# Altium project Microscope_Lamp.PrjPcb
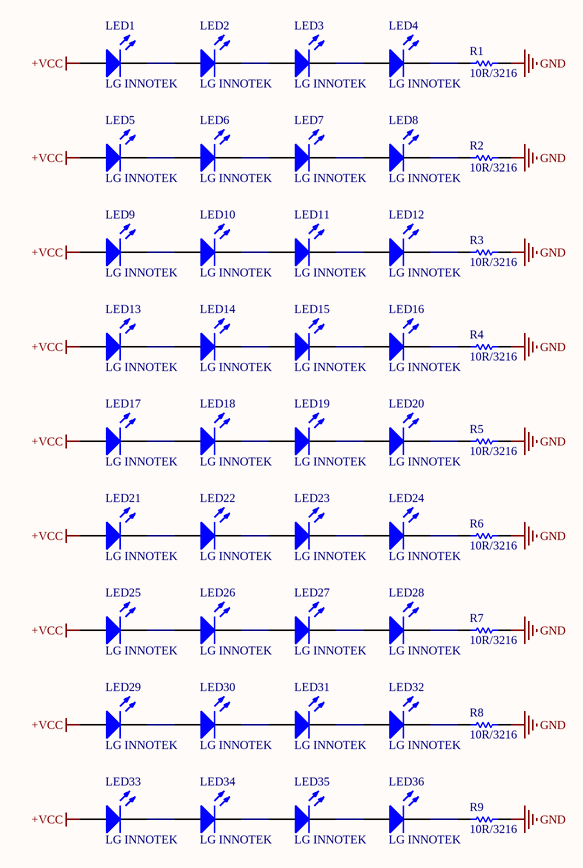
[diagram p0: Microscope_Lamp.SchDoc]
1 sheet, 45 parts. Net scope: global (net labels, ports and power ports of the same name join across sheets).
Board file: Microscope_Lamp.PcbDoc

## Sheet Microscope_Lamp.SchDoc
size A4

### Parts
LED1  LG INNOTEK  [LED_5630]
LED2  LG INNOTEK  [LED_5630]
LED3  LG INNOTEK  [LED_5630]
LED4  LG INNOTEK  [LED_5630]
LED5  LG INNOTEK  [LED_5630]
LED6  LG INNOTEK  [LED_5630]
LED7  LG INNOTEK  [LED_5630]
LED8  LG INNOTEK  [LED_5630]
LED9  LG INNOTEK  [LED_5630]
LED10  LG INNOTEK  [LED_5630]
LED11  LG INNOTEK  [LED_5630]
LED12  LG INNOTEK  [LED_5630]
LED13  LG INNOTEK  [LED_5630]
LED14  LG INNOTEK  [LED_5630]
LED15  LG INNOTEK  [LED_5630]
LED16  LG INNOTEK  [LED_5630]
LED17  LG INNOTEK  [LED_5630]
LED18  LG INNOTEK  [LED_5630]
LED19  LG INNOTEK  [LED_5630]
LED20  LG INNOTEK  [LED_5630]
LED21  LG INNOTEK  [LED_5630]
LED22  LG INNOTEK  [LED_5630]
LED23  LG INNOTEK  [LED_5630]
LED24  LG INNOTEK  [LED_5630]
LED25  LG INNOTEK  [LED_5630]
LED26  LG INNOTEK  [LED_5630]
LED27  LG INNOTEK  [LED_5630]
LED28  LG INNOTEK  [LED_5630]
LED29  LG INNOTEK  [LED_5630]
LED30  LG INNOTEK  [LED_5630]
LED31  LG INNOTEK  [LED_5630]
LED32  LG INNOTEK  [LED_5630]
LED33  LG INNOTEK  [LED_5630]
LED34  LG INNOTEK  [LED_5630]
LED35  LG INNOTEK  [LED_5630]
LED36  LG INNOTEK  [LED_5630]
R1  10R/3216  [RES3216X07N]
R2  10R/3216  [RES3216X07N]
R3  10R/3216  [RES3216X07N]
R4  10R/3216  [RES3216X07N]
R5  10R/3216  [RES3216X07N]
R6  10R/3216  [RES3216X07N]
R7  10R/3216  [RES3216X07N]
R8  10R/3216  [RES3216X07N]
R9  10R/3216  [RES3216X07N]

### Nets
+VCC: LED1.1(A) LED5.1(A) LED9.1(A) LED13.1(A) LED17.1(A) LED21.1(A) LED25.1(A) LED29.1(A) LED33.1(A)
GND: R1.2 R2.2 R3.2 R4.2 R5.2 R6.2 R7.2 R8.2 R9.2
NetLED1_2: LED1.2(K) LED2.1(A)
NetLED2_2: LED2.2(K) LED3.1(A)
NetLED3_2: LED3.2(K) LED4.1(A)
NetLED4_2: LED4.2(K) R1.1
NetLED5_2: LED5.2(K) LED6.1(A)
NetLED6_2: LED6.2(K) LED7.1(A)
NetLED7_2: LED7.2(K) LED8.1(A)
NetLED8_2: LED8.2(K) R2.1
NetLED9_2: LED9.2(K) LED10.1(A)
NetLED10_2: LED10.2(K) LED11.1(A)
NetLED11_2: LED11.2(K) LED12.1(A)
NetLED12_2: LED12.2(K) R3.1
NetLED13_2: LED13.2(K) LED14.1(A)
NetLED14_2: LED14.2(K) LED15.1(A)
NetLED15_2: LED15.2(K) LED16.1(A)
NetLED16_2: LED16.2(K) R4.1
NetLED17_2: LED17.2(K) LED18.1(A)
NetLED18_2: LED18.2(K) LED19.1(A)
NetLED19_2: LED19.2(K) LED20.1(A)
NetLED20_2: LED20.2(K) R5.1
NetLED21_2: LED21.2(K) LED22.1(A)
NetLED22_2: LED22.2(K) LED23.1(A)
NetLED23_2: LED23.2(K) LED24.1(A)
NetLED24_2: LED24.2(K) R6.1
NetLED25_2: LED25.2(K) LED26.1(A)
NetLED26_2: LED26.2(K) LED27.1(A)
NetLED27_2: LED27.2(K) LED28.1(A)
NetLED28_2: LED28.2(K) R7.1
NetLED29_2: LED29.2(K) LED30.1(A)
NetLED30_2: LED30.2(K) LED31.1(A)
NetLED31_2: LED31.2(K) LED32.1(A)
NetLED32_2: LED32.2(K) R8.1
NetLED33_2: LED33.2(K) LED34.1(A)
NetLED34_2: LED34.2(K) LED35.1(A)
NetLED35_2: LED35.2(K) LED36.1(A)
NetLED36_2: LED36.2(K) R9.1

### Library data of the parts
LED1-LED36 = LED1: Typical RED GaAs LED
R1-R9 = Res1: Resistor